# Altium schematic sheet Charge.SchDoc
size A4
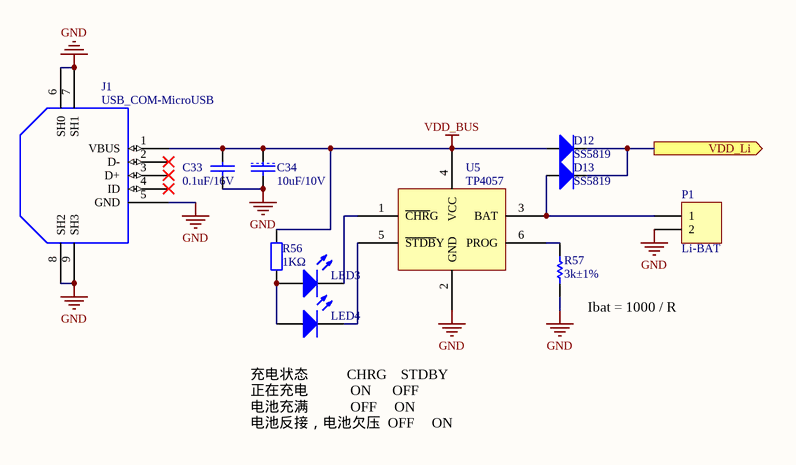
[diagram p0: Charge.SchDoc]

## Parts
C33  0.1uF/16V  [0603R]
C34  10uF/10V  [0805R]
D12  SS5819  [SMA]
D13  SS5819  [SMA]
J1  USB_COM-MicroUSB  [USB_MINIB_SMT]
LED3  LED-0805  [LED-0603]  (value not drawn)
LED4  LED-0805  [LED-0603]  (value not drawn)
P1  Li-BAT  [CON2-2.0]
R56  1KΩ  [0603R]
R57  3k±1%  [0603R]
U5  TP4057  [SOT23-6]

## Ports
VDD_Li (out)

## Nets
GND: C33.2 C34.2 J1.5(GND) J1.6(SH0) J1.7(SH1) J1.8(SH2) J1.9(SH3) P1.2 R57.1 U5.2(GND)
VDD_BUS: C33.1 C34.1 D12.1(A) J1.1(VBUS) R56.1 U5.4(VCC)
VDD_Li: D12.2(K) D13.2(K) ; port VDD_Li
NetD13_1: D13.1(A) P1.1 U5.3(BAT)
NetLED3_1: LED3.1(A) LED4.1(A) R56.2
NetLED3_2: LED3.2(K) U5.1(~{CHR}G)
NetLED4_2: LED4.2(K) U5.5(~{STDB}Y)
NetR57_2: R57.2 U5.6(PROG)

Not connected (* = marked no-connect by the designer): J1 2(D-)* 3(D+)* 4(ID)*

## Notes on the sheet
- (near R57) Ibat = 1000 / R
- (near LED4) 充电状态           CHRG    STDBY
  正在充电            ON      OFF
  电池充满            OFF     ON
  电池反接，电池欠压  OFF     ON
- Drawing Name
- 图纸名称
- Drawing
- 制图
- Auditing
- 审核
- EnvMonitor
- Confirming
- 批准
- Version
- 版本号
- 小甘工作室
- V1.00
- 日期
- Date
- Jack
- XiaoGan Studio

## Library data of the parts
C33 C34 = CAP: 贴片陶瓷电容; Kind: 贴片陶瓷电容
  C34: Author: 叶建峰
D12 D13 = Diode 1N914: 贴片二极管; Remark: 可用1N5819替代; Kind: 贴片二极管; Author: 叶建峰
J1 = USB_COM-MiniUSB: Text Field1: 100; Text Field2: 80
LED3 LED4 = LED_0603: LED_0603 Typical RED, GREEN, YELLOW, AMBER GaAs LED; Type: RED; Package: 0603
P1 = Header 2: Header, 2-Pin; LatestRevisionDate: 17-Jul-2002; LatestRevisionNote: Re-released for DXP Platform.; Publisher: Altium Limited
R56 = RES_0603: OEMs: *; Type: 10KΩ; Package: 0603
R57 = Res1: 贴片电阻; Kind: 贴片电阻
U5 = TP4057: 锂电充电芯片; Manufacturer: 南京拓微集成电路; Kind: 集成电路; Remark: 关键元器件; Author: 叶建峰